# EAGLE schematic E-Reader (EAGLE 9.7.0)
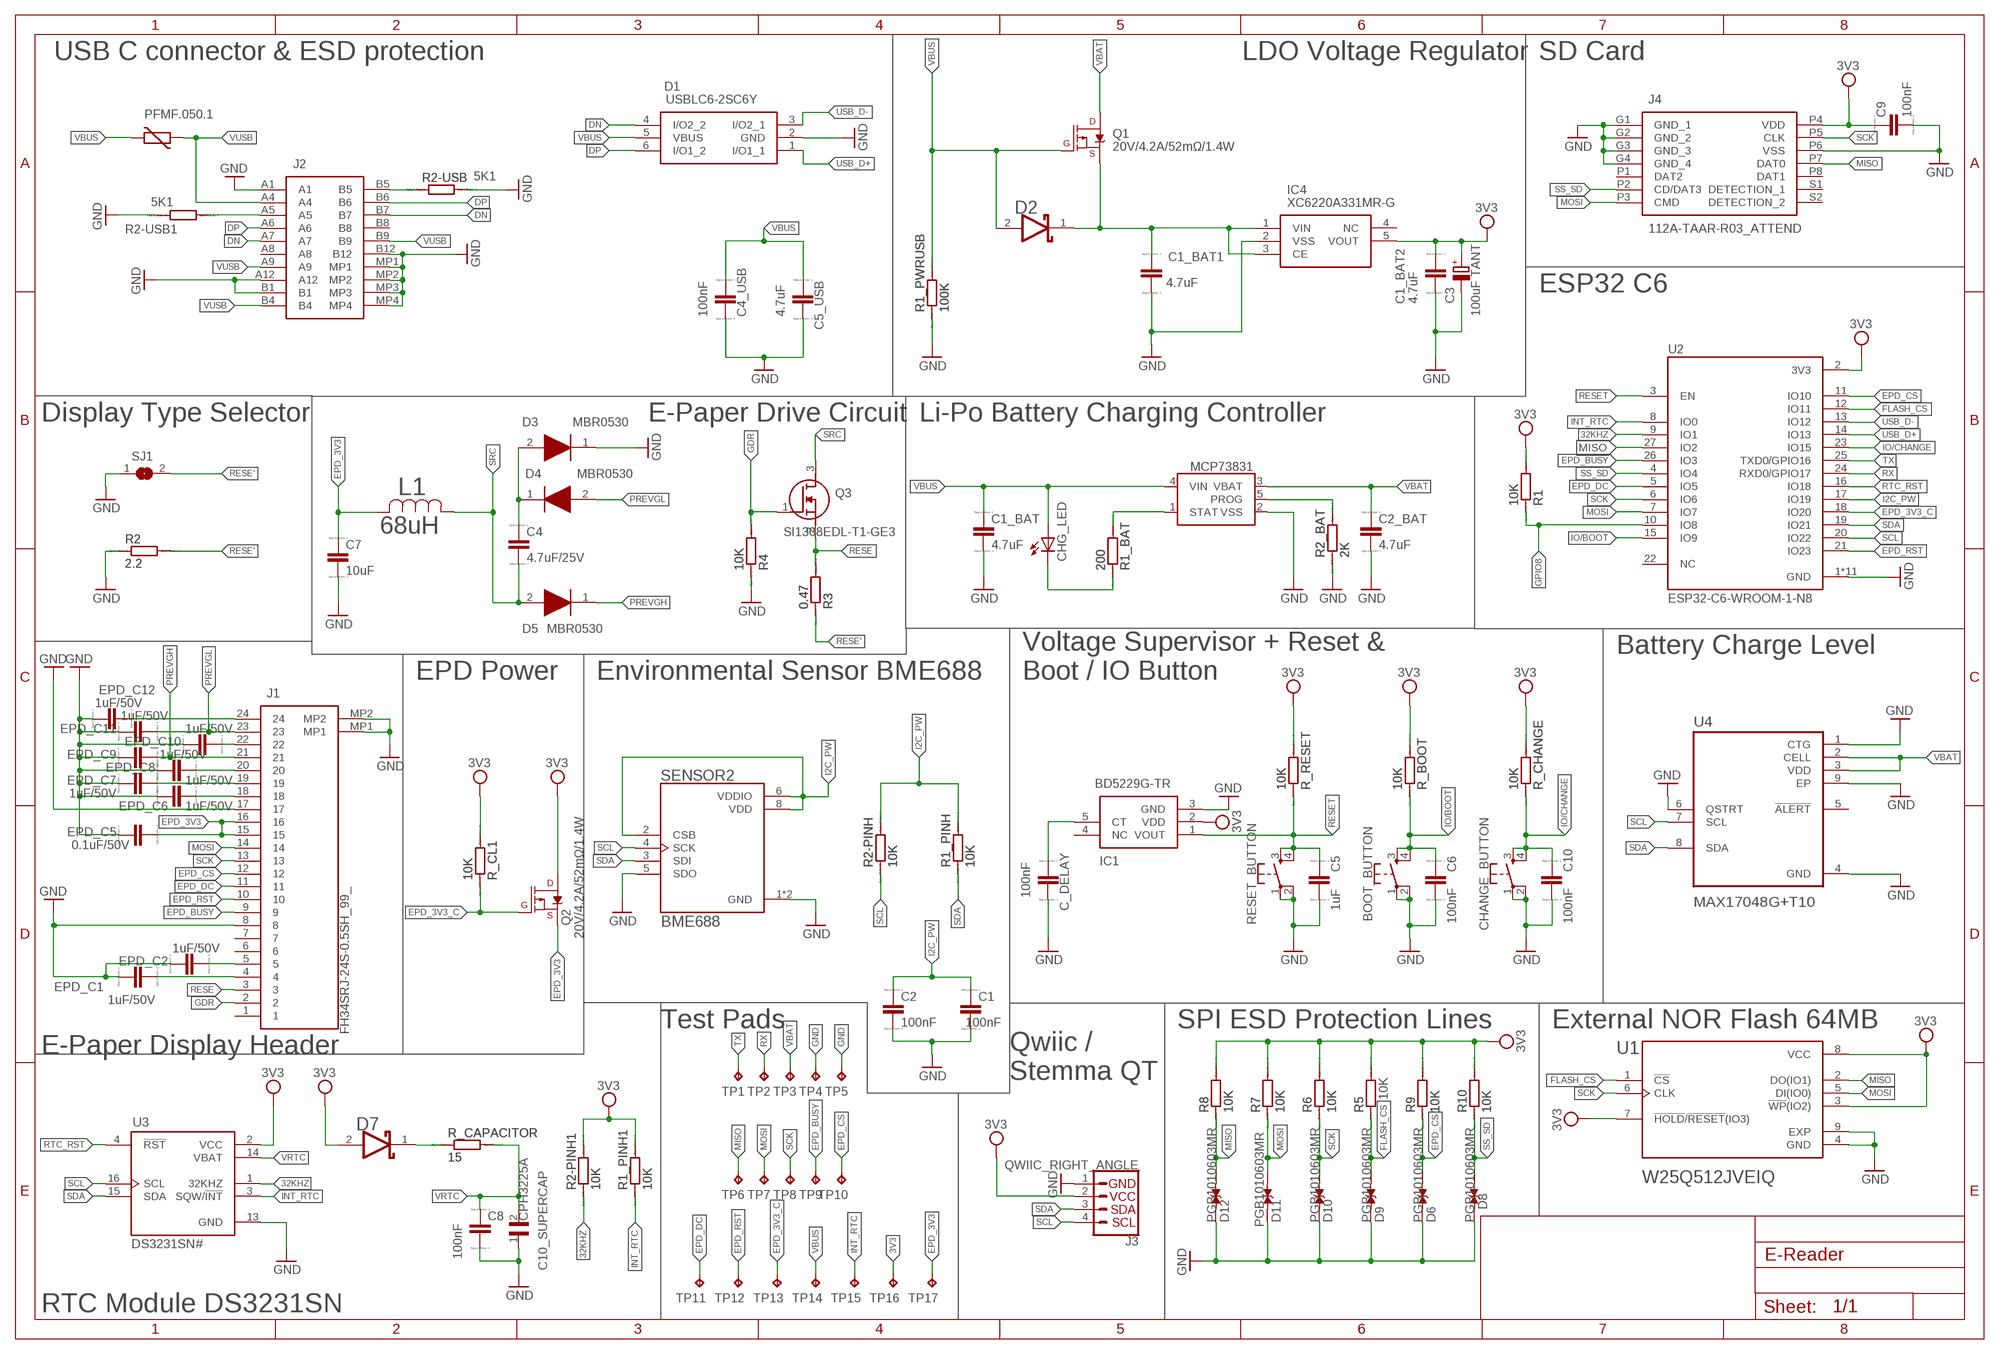
[diagram p0: schematic, sheet 1]

## Parts
BOOT_BUTTON  BUTTON_CUSYOMV1  [MYBUTTON]
C1  100nF  EAGLE-LTSPICE_CC0402  [EAGLE-LTSPICE_C0402]
C1_BAT  4.7uF  EAGLE-LTSPICE_CC0402  [EAGLE-LTSPICE_C0402]
C1_BAT1  4.7uF  EAGLE-LTSPICE_CC0402  [EAGLE-LTSPICE_C0402]
C1_BAT2  4.7uF  EAGLE-LTSPICE_CC0402  [EAGLE-LTSPICE_C0402]
C2  100nF  EAGLE-LTSPICE_CC0402  [EAGLE-LTSPICE_C0402]
C2_BAT  4.7uF  EAGLE-LTSPICE_CC0402  [EAGLE-LTSPICE_C0402]
C3  100uF TANT  RCL_CPOL-EUCT3528  [RCL_CT3528]
C4  4.7uF/25V  EAGLE-LTSPICE_CC0402  [EAGLE-LTSPICE_C0402]
C4_USB  100nF  EAGLE-LTSPICE_CC0402  [EAGLE-LTSPICE_C0402]
C5  1uF  EAGLE-LTSPICE_CC0402  [EAGLE-LTSPICE_C0402]
C5_USB  4.7uF  EAGLE-LTSPICE_CC0402  [EAGLE-LTSPICE_C0402]
C6  100nF  EAGLE-LTSPICE_CC0402  [EAGLE-LTSPICE_C0402]
C7  10uF  EAGLE-LTSPICE_CC0402  [EAGLE-LTSPICE_C0402]
C8  100nF  EAGLE-LTSPICE_CC0402  [EAGLE-LTSPICE_C0402]
C9  100nF  EAGLE-LTSPICE_CC0402  [EAGLE-LTSPICE_C0402]
C10  100nF  EAGLE-LTSPICE_CC0402  [EAGLE-LTSPICE_C0402]
C10_SUPERCAP  CPH3225A  [CAPCP3225X100N]
C_DELAY  100nF  EAGLE-LTSPICE_CC0402  [EAGLE-LTSPICE_C0402]
CHANGE_BUTTON  BUTTON_CUSYOMV1  [MYBUTTON]
CHG_LED  ADAFRUIT_LEDCHIP-LED0603  [ADAFRUIT_CHIP-LED0603]
D1  USBLC6-2SC6Y  [SOT95P280X145-6N]
D2  ESP32_WROVER_AVX---SD0805S020S1R0_AVX_SD0805S020S1R0_0_0AVX_SD0805S020S1R0_0_0  [ESP32_WROVER_AVX---SD0805S020S1R0_AVX_SD0805S020S1R0_0]
D3  MBR0530  [SOD3716X135N]
D4  MBR0530  [SOD3716X135N]
D5  MBR0530  [SOD3716X135N]
D6  PGB1010603MR  [DIOC1608X36N]
D7  ESP32_WROVER_AVX---SD0805S020S1R0_AVX_SD0805S020S1R0_0_0AVX_SD0805S020S1R0_0_0  [ESP32_WROVER_AVX---SD0805S020S1R0_AVX_SD0805S020S1R0_0]
D8  PGB1010603MR  [DIOC1608X36N]
D9  PGB1010603MR  [DIOC1608X36N]
D10  PGB1010603MR  [DIOC1608X36N]
D11  PGB1010603MR  [DIOC1608X36N]
D12  PGB1010603MR  [DIOC1608X36N]
EPD_C1  1uF/50V  EAGLE-LTSPICE_CC0402  [EAGLE-LTSPICE_C0402]
EPD_C2  1uF/50V  EAGLE-LTSPICE_CC0402  [EAGLE-LTSPICE_C0402]
EPD_C5  0.1uF/50V  EAGLE-LTSPICE_CC0402  [EAGLE-LTSPICE_C0402]
EPD_C6  1uF/50V  EAGLE-LTSPICE_CC0402  [EAGLE-LTSPICE_C0402]
EPD_C7  1uF/50V  EAGLE-LTSPICE_CC0402  [EAGLE-LTSPICE_C0402]
EPD_C8  1uF/50V  EAGLE-LTSPICE_CC0402  [EAGLE-LTSPICE_C0402]
EPD_C9  1uF/50V  EAGLE-LTSPICE_CC0402  [EAGLE-LTSPICE_C0402]
EPD_C10  1uF/50V  EAGLE-LTSPICE_CC0402  [EAGLE-LTSPICE_C0402]
EPD_C11  1uF/50V  EAGLE-LTSPICE_CC0402  [EAGLE-LTSPICE_C0402]
EPD_C12  1uF/50V  EAGLE-LTSPICE_CC0402  [EAGLE-LTSPICE_C0402]
IC1  BD5229G-TR  [SOT95P280X125-5N]
IC4  XC6220A331MR-G  [SOT95P280X120-5N]
J1  FH34SRJ-24S-0.5SH_99_  [FH34SRJ24S05SH99]
J2  SAMACSYS_PARTS_USB4110-GF-A  [SAMACSYS_PARTS_USB4110GFA]
J3  QWIIC_RIGHT_ANGLE  QWIIC_CONNECTORJS-1MM  [JST04_1MM_RA]
J4  112A-TAAR-R03_ATTEND  [112ATAARR03ATTEND]
L1  68uH  744043680IND_4828-WE-TPC_WRE  [IND_4828-WE-TPC_WRE]
MCP73831  ESP32_WROVER_SPARKFUN-IC-POWER_MCP73831  [ESP32_WROVER_SPARKFUN-IC-POWER_SOT23-5]
PFMF.050.1  ESP32C6_VARISTORCN1812  [ESP32C6_VARISTOR_CT/CN1812]
Q1  20V/4.2A/52mΩ/1.4W  ESP32_WROVER_SPARKFUN-DISCRETESEMI_MOSFET_PCH-DMG2305UX-7  [ESP32_WROVER_SPARKFUN-DISCRETESEMI_SOT23-3]
Q2  20V/4.2A/52mΩ/1.4W  ESP32_WROVER_SPARKFUN-DISCRETESEMI_MOSFET_PCH-DMG2305UX-7  [ESP32_WROVER_SPARKFUN-DISCRETESEMI_SOT23-3]
Q3  SI1308EDL-T1-GE3  [SOT65P210X110-3N]
R1  10K  ESP32_WROVER_EAGLE-LTSPICE_RR0402  [ESP32_WROVER_EAGLE-LTSPICE_R0402]
R1_BAT  200  ESP32_WROVER_EAGLE-LTSPICE_RR0402  [ESP32_WROVER_EAGLE-LTSPICE_R0402]
R1_PINH  10K  ESP32_WROVER_EAGLE-LTSPICE_RR0402  [ESP32_WROVER_EAGLE-LTSPICE_R0402]
R1_PINH1  10K  ESP32_WROVER_EAGLE-LTSPICE_RR0402  [ESP32_WROVER_EAGLE-LTSPICE_R0402]
R1_PWRUSB  100K  ESP32_WROVER_EAGLE-LTSPICE_RR0402  [ESP32_WROVER_EAGLE-LTSPICE_R0402]
R2  2.2  ESP32_WROVER_EAGLE-LTSPICE_RR0402  [ESP32_WROVER_EAGLE-LTSPICE_R0402]
R2-PINH  10K  ESP32_WROVER_EAGLE-LTSPICE_RR0402  [ESP32_WROVER_EAGLE-LTSPICE_R0402]
R2-PINH1  10K  ESP32_WROVER_EAGLE-LTSPICE_RR0402  [ESP32_WROVER_EAGLE-LTSPICE_R0402]
R2-USB  5K1  ESP32_WROVER_EAGLE-LTSPICE_RR0402  [ESP32_WROVER_EAGLE-LTSPICE_R0402]
R2-USB1  5K1  ESP32_WROVER_EAGLE-LTSPICE_RR0402  [ESP32_WROVER_EAGLE-LTSPICE_R0402]
R2_BAT  2K  ESP32_WROVER_EAGLE-LTSPICE_RR0402  [ESP32_WROVER_EAGLE-LTSPICE_R0402]
R3  0.47  ESP32_WROVER_EAGLE-LTSPICE_RR0402  [ESP32_WROVER_EAGLE-LTSPICE_R0402]
R4  10K  ESP32_WROVER_EAGLE-LTSPICE_RR0402  [ESP32_WROVER_EAGLE-LTSPICE_R0402]
R5  10K  ESP32_WROVER_EAGLE-LTSPICE_RR0402  [ESP32_WROVER_EAGLE-LTSPICE_R0402]
R6  10K  ESP32_WROVER_EAGLE-LTSPICE_RR0402  [ESP32_WROVER_EAGLE-LTSPICE_R0402]
R7  10K  ESP32_WROVER_EAGLE-LTSPICE_RR0402  [ESP32_WROVER_EAGLE-LTSPICE_R0402]
R8  10K  ESP32_WROVER_EAGLE-LTSPICE_RR0402  [ESP32_WROVER_EAGLE-LTSPICE_R0402]
R9  10K  ESP32_WROVER_EAGLE-LTSPICE_RR0402  [ESP32_WROVER_EAGLE-LTSPICE_R0402]
R10  10K  ESP32_WROVER_EAGLE-LTSPICE_RR0402  [ESP32_WROVER_EAGLE-LTSPICE_R0402]
R_BOOT  10K  ESP32_WROVER_EAGLE-LTSPICE_RR0402  [ESP32_WROVER_EAGLE-LTSPICE_R0402]
R_CAPACITOR  15  ESP32_WROVER_EAGLE-LTSPICE_RR0402  [ESP32_WROVER_EAGLE-LTSPICE_R0402]
R_CHANGE  10K  ESP32_WROVER_EAGLE-LTSPICE_RR0402  [ESP32_WROVER_EAGLE-LTSPICE_R0402]
R_CL1  10K  ESP32_WROVER_EAGLE-LTSPICE_RR0402  [ESP32_WROVER_EAGLE-LTSPICE_R0402]
R_RESET  10K  ESP32_WROVER_EAGLE-LTSPICE_RR0402  [ESP32_WROVER_EAGLE-LTSPICE_R0402]
RESET_BUTTON  BUTTON_CUSYOMV1  [MYBUTTON]
SENSOR2  BME688  ESP32_WROVER_BME680_BME680  [ESP32_WROVER_BME680_PSON80P300X300X100-8N]
SJ1  SJ  [SJ]
TP1  TPTP20R  [TP20R]
TP2  TPTP20R  [TP20R]
TP3  TPTP20R  [TP20R]
TP4  TPTP20R  [TP20R]
TP5  TPTP20R  [TP20R]
TP6  TPTP20R  [TP20R]
TP7  TPTP20R  [TP20R]
TP8  TPTP20R  [TP20R]
TP9  TPTP20R  [TP20R]
TP10  TPTP20R  [TP20R]
TP11  TPTP20R  [TP20R]
TP12  TPTP20R  [TP20R]
TP13  TPTP20R  [TP20R]
TP14  TPTP20R  [TP20R]
TP15  TPTP20R  [TP20R]
TP16  TPTP20R  [TP20R]
TP17  TPTP20R  [TP20R]
U1  W25Q512JVEIQ  [SON127P600X800X80-9N]
U2  ESP32-C6-WROOM-1-N8  [XCVR_ESP32-C6-WROOM-1-N8]
U3  DS3231SN#  [SOIC127P1032X265-16N]
U4  MAX17048G+T10  [SON50P200X200X80-9N]

## Nets
3V3: C1_BAT2.1 C3.+ C9.1 D7.2(ANODE) IC1.2(VDD) IC4.5(VOUT) J3.2 J4.P4(VDD) Q2.3(D) R1.2 R1_PINH1.2 R2-PINH1.2 R5.2 R6.2 R7.2 R8.2 R9.2 R10.2 R_BOOT.2 R_CHANGE.2 R_CL1.2 R_RESET.2 TP16.TP U1.3(!WP!(IO2)) U1.7(!HOLD!/!RESET!(IO3)) U1.8(VCC) U2.2(3V3) U3.2(VCC)
32KHZ: R2-PINH1.1 U2.9(IO1) U3.1(32KHZ)
DN: D1.4(I/O2_2) J2.A7 J2.B7
DP: D1.6(I/O1_2) J2.A6 J2.B6
EPD_3V3: C7.1 EPD_C5.2 J1.15 J1.16 L1.2 Q2.2(S) TP17.TP
EPD_3V3_C: Q2.1(G) R_CL1.1 TP13.TP U2.18(IO20)
EPD_BUSY: J1.9 TP9.TP U2.26(IO3)
EPD_CS: D6.2 J1.12 R9.1 TP10.TP U2.11(IO10)
EPD_DC: J1.11 TP11.TP U2.5(IO5)
EPD_RST: J1.10 TP12.TP U2.21(IO23)
FLASH_CS: D9.2 R5.1 U1.1(!CS) U2.12(IO11)
GDR: J1.2 Q3.1(G) R4.2
GND: BOOT_BUTTON.1 BOOT_BUTTON.2 C1.2 C1_BAT1.2 C1_BAT2.2 C1_BAT.2 C2.2 C2_BAT.2 C3.- C4_USB.2 C5.2 C5_USB.2 C6.2 C7.2 C8.2 C9.2 C10.2 C10_SUPERCAP.1 C_DELAY.2 CHANGE_BUTTON.1 CHANGE_BUTTON.2 D1.2(GND) D3.1(K) D6.1 D8.1 D9.1 D10.1 D11.1 D12.1 EPD_C1.1 EPD_C2.1 EPD_C5.1 EPD_C6.1 EPD_C7.1 EPD_C8.1 EPD_C9.1 EPD_C10.1 EPD_C11.1 EPD_C12.1 IC1.3(GND) IC4.2(VSS) J1.8 J1.17 J1.MP1 J1.MP2 J2.A1 J2.A12 J2.B1 J2.B12 J2.MP1 J2.MP2 J2.MP3 J2.MP4 J3.1 J4.G1(GND_1) J4.G2(GND_2) J4.G3(GND_3) J4.G4(GND_4) J4.P6(VSS) MCP73831.2(VSS) R1_PWRUSB.1 R2-USB1.1 R2-USB.2 R2.1 R2_BAT.1 R4.1 RESET_BUTTON.1 RESET_BUTTON.2 SENSOR2.1(GND) SENSOR2.5(SDO) SENSOR2.7(GND) SJ1.1 TP4.TP TP5.TP U1.4(GND) U1.9(EXP) U2.1(GND) U2.28(GND) U2.29_1(GND) U2.29_2(GND) U2.29_3(GND) U2.29_4(GND) U2.29_5(GND) U2.29_6(GND) U2.29_7(GND) U2.29_8(GND) U2.29_9(GND) U3.13(GND) U4.1(CTG) U4.4(GND) U4.6(QSTRT) U4.9(EP)
GPIO8: R1.1 U2.10(IO8)
I2C_PW: C1.1 C2.1 R1_PINH.2 R2-PINH.2 SENSOR2.2(CSB) SENSOR2.6(VDDIO) SENSOR2.8(VDD) U2.17(IO19)
INT_RTC: R1_PINH1.1 TP15.TP U2.8(IO0) U3.3(SQW/!INT)
IO/BOOT: BOOT_BUTTON.3 BOOT_BUTTON.4 C6.1 R_BOOT.1 U2.15(IO9)
IO/CHANGE: C10.1 CHANGE_BUTTON.3 CHANGE_BUTTON.4 R_CHANGE.1 U2.23(IO15)
MISO: D12.2 J4.P7(DAT0) R8.1 TP6.TP U1.2(DO(IO1)) U2.27(IO2)
MOSI: D11.2 J1.14 J4.P3(CMD) R7.1 TP7.TP U1.5(DI(IO0)) U2.7(IO7)
N$1: C1_BAT1.1 D2.1(CATHODE) IC4.1(VIN) IC4.3(CE) Q1.2(S)
N$2: MCP73831.5(PROG) R2_BAT.2
N$3: MCP73831.1(STAT) R1_BAT.2
N$4: CHG_LED.C R1_BAT.1
N$5: C_DELAY.1 IC1.5(CT)
N$6: EPD_C6.2 J1.18
N$7: C4.1 D3.2(A) D4.1(K)
N$8: EPD_C7.2 J1.19
N$9: EPD_C1.2 J1.4
N$11: EPD_C2.2 J1.5
N$12: D7.1(CATHODE) R_CAPACITOR.1
N$13: EPD_C8.2 J1.20
N$14: J2.B5 R2-USB.1
N$17: EPD_C10.2 J1.22
N$18: J2.A5 R2-USB1.2
N$20: EPD_C12.2 J1.24
PREVGH: D5.1(K) EPD_C9.2 J1.21
PREVGL: D4.2(A) EPD_C11.2 J1.23
RESE: J1.3 Q3.2(S) R3.2
RESE': R2.2 R3.1 SJ1.2
RESET: C5.1 IC1.1(VOUT) R_RESET.1 RESET_BUTTON.3 RESET_BUTTON.4 U2.3(EN)
RTC_RST: U2.16(IO18) U3.4(!RST)
RX: TP2.TP U2.24(RXD0/GPIO17)
SCK: D10.2 J1.13 J4.P5(CLK) R6.1 TP8.TP U1.6(CLK) U2.6(IO6)
SCL: J3.4 R2-PINH.1 SENSOR2.4(SCK) U2.20(IO22) U3.16(SCL) U4.7(SCL)
SDA: J3.3 R1_PINH.1 SENSOR2.3(SDI) U2.19(IO21) U3.15(SDA) U4.8(SDA)
SRC: C4.2 D5.2(A) L1.1 Q3.3(D)
SS_SD: D8.2 J4.P2(CD/DAT3) R10.1 U2.4(IO4)
TX: TP1.TP U2.25(TXD0/GPIO16)
USB_D+: D1.1(I/O1_1) U2.14(IO13)
USB_D-: D1.3(I/O2_1) U2.13(IO12)
VBAT: C2_BAT.1 MCP73831.3(VBAT) Q1.3(D) TP3.TP U4.2(CELL) U4.3(VDD)
VBUS: C1_BAT.1 C4_USB.1 C5_USB.1 CHG_LED.A D1.5(VBUS) D2.2(ANODE) MCP73831.4(VIN) PFMF.050.1.2 Q1.1(G) R1_PWRUSB.2 TP14.TP
VRTC: C8.1 C10_SUPERCAP.2 R_CAPACITOR.2 U3.14(VBAT)
VUSB: J2.A4 J2.A9 J2.B4 J2.B9 PFMF.050.1.1
Unconnected: IC1.4(NC) IC4.4(NC) J1.1 J1.6 J1.7 J2.A8 J2.B8 J4.P1(DAT2) J4.P8(DAT1) J4.S1(DETECTION_1) J4.S2(DETECTION_2) U2.22(NC) U4.5(!ALERT)

## Notes on the sheet
- USB C connector & ESD protection | LDO Voltage Regulator | SD Card
- ESP32 C6
- Display Type Selector | E-Paper Drive Circuit | Li-Po Battery Charging Controller
- Battery Charge Level
- EPD Power | Environmental Sensor BME688
- Voltage Supervisor + Reset &
  Boot / IO Button
- Test Pads | SPI ESD Protection Lines | External NOR Flash 64MB
- E-Paper Display Header
- Qwiic /
  Stemma QT
- RTC Module DS3231SN

## Library data of the parts
BOOT_BUTTON CHANGE_BUTTON RESET_BUTTON = DeskAssistant v19 v1:BUTTON_CUSYOMV1
C1 C1_BAT C1_BAT1 C1_BAT2 C2 C2_BAT C4 C4_USB C5 C5_USB C6-C10 C_DELAY EPD_C1 EPD_C2 EPD_C5-EPD_C12 = DeskAssistant v19 v1:EAGLE-LTSPICE_C: CAPACITOR, European symbol; SPICEMODEL: NONE; SPICEPREFIX: C
C3 = DeskAssistant v19 v1:RCL_CPOL-EU: POLARIZED CAPACITOR, European symbol; SPICEPREFIX: C
C10_SUPERCAP = DeskAssistant v19 v1:CPH3225A: Cap 0.011F 3.3V 1210 Flat Check availability <https://pricing.snapeda.com/parts/CPH3225A/Seiko%20Instruments/view-part?ref=eda>; AVAILABILITY: Not in stock; CHECK_PRICES: https://www.snapeda.com/parts/CPH3225A/Seiko+Instruments/view-part/?ref=eda; DESCRIPTION: 11 mF (EDLC) Supercapacitor 3.3 V 1210 (3225 Metric) - -; MF: Seiko Instruments; MP: CPH3225A; PACKAGE: 1210 Seiko; PRICE: None; PURCHASE-URL: https://www.snapeda.com/api/url_track_click_mouser/?unipart_id=562593&manufacturer=Seiko Instruments&part_name=CPH3225A&search_term=None; SNAPEDA_LINK: https://www.snapeda.com/parts/CPH3225A/Seiko+Instruments/view-part/?ref=snap
CHG_LED = DeskAssistant v19 v1:ADAFRUIT_LED: LED OSRAM: - CHIPLED LG R971, LG N971, LY N971, LG Q971, LY Q971, LO R971, LY R971 LH N974, LH R974 LS Q976, LO Q976, LY Q976 LO Q996 - Hyper CHIPLED LW Q18S LB Q993, LB Q99A, LB R99A - SideLED LS A670, LO A670, LY A670, LG A670, LP A670 LB A673, LV A673, LT A673, LW A673 LH A674 LY A675 LS A676, LA A676, LO A676, LY A676, LW A676 LS A679, LY A679, LG A679 - Hyper Micro SIDELED® LS Y876, LA Y876, LO Y876, LY Y876 LT Y87S - SmartLED LW L88C, LW L88S LB L89C, LB L89S, LG L890 LS L89K, LO L89K, LY L89K LS L896, LA L896, LO L896, LY L896 - TOPLED LS T670, LO T670, LY T670, LG T670, LP T670 LSG T670, LSP T670, LSY T670, LOP T670, LYG T670 LG T671, LOG T671, LSG T671 LB T673, LV T673, LT T673, LW T673 LH T674 LS T676, LA T676, LO T676, LY T676, LB T676, LH T676, LSB T676, LW T676 LB T67C, LV T67C, LT T67C, LS T67K, LO T67K, LY T67K, LW E67C LS E67B, LA E67B, LO E67B, LY E67B, LB E67C, LV E67C, LT E67C LW T67C LS T679, LY T679, LG T679 LS T770, LO T770, LY T770, LG T770, LP T770 LB T773, LV T773, LT T773, LW T773 LH T774 LS E675, LA E675, LY E675, LS T675 LS T776, LA T776, LO T776, LY T776, LB T776 LHGB T686 LT T68C, LB T68C - Hyper Mini TOPLED® LB M676 - Mini TOPLED Santana® LG M470 LS M47K, LO M47K, LY M47K Source: http://www.osram.convergy.de/
D1 = DeskAssistant v19 v1:USBLC6-2SC6Y: Low Cap. ESD Protection Auto SOT-23-6 STMicroelectronics USBLC6-2SC6Y, Dual Uni-Directional TVS Diode Array, 6-Pin SOT-23 Source: Datasheet <https://componentsearchengine.com/Datasheets/1/USBLC6-2SC6Y.pdf> Check availability <https://pricing.snapeda.com/parts/USBLC6-2SC6Y/STMicroelectronics/view-part?ref=eda>; AVAILABILITY: In Stock; CHECK_PRICES: https://www.snapeda.com/parts/USBLC6-2SC6Y/STMicroelectronics/view-part/?ref=eda; DESCRIPTION: 17V Clamp 5A (8/20µs) Ipp Tvs Diode Surface Mount SOT-23-6; MF: STMicroelectronics; MP: USBLC6-2SC6Y; PACKAGE: SOT-23-6 STMicroelectronics; PRICE: None; SNAPEDA_LINK: https://www.snapeda.com/parts/USBLC6-2SC6Y/STMicroelectronics/view-part/?ref=snap
D2 D7 = DeskAssistant v19 v1:ESP32_WROVER_AVX---SD0805S020S1R0_AVX_SD0805S020S1R0_0_0: Schottky Barrier Rectifier Diode; CENTROID_NOT_SPECIFIED: No; DATASHEET: http://datasheets.avx.com/schottky.pdf; DIGIKEY_DESCRIPTION: DIODE SCHOTTKY 20V 1A 0805; DIGIKEY_PART_NUMBER: 478-7800-1-ND; LEAD_FREE: yes; MF: AVX; MOUSER_PART_NUMBER: 581-SD0805S020S1R0; PACKAGE: 0805 (2012 metric); PREFIX: D; ROHS: yes; TEMPERATURE_RANGE_HIGH: +125°C; TEMPERATURE_RANGE_LOW: -55°C
D3-D5 = DeskAssistant v19 v1:MBR0530: ON SEMICONDUCTOR - MBR0530 - DIODE, SCHOTTKY, 0.5A, 30V, SOD-123 Source: Datasheet <http://www.onsemi.com/pub/Collateral/MBR0530T1-D.PDF> Check availability <https://pricing.snapeda.com/parts/MBR0530/ON%20Semiconductor/view-part?ref=eda>; AVAILABILITY: In Stock; CHECK_PRICES: https://www.snapeda.com/parts/MBR0530/Onsemi/view-part/?ref=eda; DESCRIPTION: Diode Schottky 30 V 500mA Surface Mount SOD-123; MF: ON Semiconductor; MP: MBR0530; PACKAGE: SOD-123-2 ON Semiconductor; PRICE: None; PURCHASE-URL: https://www.snapeda.com/api/url_track_click_mouser/?unipart_id=179458&manufacturer=ON Semiconductor&part_name=MBR0530&search_term=None; SNAPEDA_LINK: https://www.snapeda.com/parts/MBR0530/Onsemi/view-part/?ref=snap
D6 D8-D12 = DeskAssistant v19 v1:PGB1010603MR: Check availability <https://pricing.snapeda.com/parts/PGB1010603MR/Littelfuse%20Inc./view-part?ref=eda>; AVAILABILITY: In Stock; CHECK_PRICES: https://www.snapeda.com/parts/PGB1010603MR/Littelfuse/view-part/?ref=eda; DESCRIPTION: 150V (Typ) Clamp - Ipp Tvs Diode Surface Mount 0603 (1608 Metric); MF: Littelfuse Inc.; MP: PGB1010603MR; PACKAGE: 0603 Littelfuse Inc.; PRICE: None; PURCHASE-URL: https://www.snapeda.com/api/url_track_click_mouser/?unipart_id=5659453&manufacturer=Littelfuse Inc.&part_name=PGB1010603MR&search_term=None; SNAPEDA_LINK: https://www.snapeda.com/parts/PGB1010603MR/Littelfuse/view-part/?ref=snap
IC1 = DeskAssistant v19 v1:BD5229G-TR: Voltage Detector with Adjustable Delay Time: CMOS processes are utilized to develop high precision, low current consumption CMOS reset ICs that allow arbitrary setting of the delay time. The extensive lineup includes both Nch Open Drain and CMOS output types in a wide range of detection voltages (from 2.3V to 6.0V, in 0.1V steps), enabling selection of the ideal solution based on customer requirements. In addition, the entire series is of course both lead-free and RoHS-compliant. Source: Datasheet <https://datasheet.datasheetarchive.com/originals/distributors/Datasheets_SAMA/f2b9741ef86007909f138d561a359946.pdf>; DESCRIPTION: Voltage Detector with Adjustable Delay Time: CMOS processes are utilized to develop high precision, low current consumption CMOS reset ICs that allow arbitrary setting of the delay time. The extensive lineup includes both Nch Open Drain and CMOS output types in a wide range of detection voltages (from 2.3V to 6.0V, in 0.1V steps), enabling selection of the ideal solution based on customer requirements. In addition, the entire series is of course both lead-free and RoHS-compliant.; HEIGHT: 1.25mm; MANUFACTURER_NAME: ROHM Semiconductor; MANUFACTURER_PART_NUMBER: BD5229G-TR; MOUSER_PART_NUMBER: 755-BD5229G-TR; MOUSER_PRICE-STOCK: https://www.mouser.co.uk/ProductDetail/ROHM-Semiconductor/BD5229G-TR?qs=4kLU8WoGk0vvnhrrYwdszw%3D%3D
IC4 = DeskAssistant v19 v1:XC6220A331MR-G: LDO Voltage Regulators Source: Datasheet <https://www.torexsemi.com/file/xc6220/XC6220.pdf>; DESCRIPTION: LDO Voltage Regulators; HEIGHT: 1.2mm; MANUFACTURER_NAME: Torex; MANUFACTURER_PART_NUMBER: XC6220A331MR-G; MOUSER_PART_NUMBER: 865-XC6220A331MR-G; MOUSER_PRICE-STOCK: https://www.mouser.co.uk/ProductDetail/Torex-Semiconductor/XC6220A331MR-G?qs=AsjdqWjXhJ8ZSWznL1J0gg%3D%3D
J1 = DeskAssistant v19 v1:FH34SRJ-24S-0.5SH_99_: 24 Position FFC, FPC Connector Contacts, Top and Bottom 0.020" (0.50mm) Surface Mount, Right Angle Source: Datasheet <https://www.hirose.com/en/product/document?clcode=CL0580-1255-6-99&productname=FH34SRJ-24S-0.5SH(99)&series=FH34SRJ&documenttype=2DDrawing&lang=en&documentid=0000990903>; DESCRIPTION: 24 Position FFC, FPC Connector Contacts, Top and Bottom 0.020" (0.50mm) Surface Mount, Right Angle; HEIGHT: 1.1mm; MANUFACTURER_NAME: Hirose; MANUFACTURER_PART_NUMBER: FH34SRJ-24S-0.5SH(99); MOUSER_PART_NUMBER: 798-FH34SRJ24S05SH99; MOUSER_PRICE-STOCK: https://www.mouser.co.uk/ProductDetail/Hirose-Connector/FH34SRJ-24S-0.5SH99?qs=vcbW%252B4%252BSTIpKBl5ap9J8Fw%3D%3D
J2 = DeskAssistant v19 v1:SAMACSYS_PARTS_USB4110-GF-A: CONN USB 2.0 TYPE-C R/A SMT Source: Datasheet <https://gct.co/files/drawings/usb4110.pdf>; DESCRIPTION: CONN USB 2.0 TYPE-C R/A SMT; HEIGHT: 3.26mm; MANUFACTURER_NAME: GCT (GLOBAL CONNECTOR TECHNOLOGY); MANUFACTURER_PART_NUMBER: USB4110-GF-A; MOUSER_PART_NUMBER: 640-USB4110-GF-A; MOUSER_PRICE-STOCK: https://www.mouser.co.uk/ProductDetail/GCT/USB4110-GF-A?qs=KUoIvG%2F9IlYiZvIXQjyJeA%3D%3D
J3 = DeskAssistant v19 v1:QWIIC_CONNECTOR: SparkFun I2C Standard Qwiic Connector An SMD 1mm pitch JST connector makes it easy and quick (get it? Qwiic?) to connect I2C devices to each other. The Qwiic system <http://www.sparkfun.com/qwiic> enables fast and solderless connection between popular platforms and various sensors and actuators. We carry 200mm <https://www.sparkfun.com/products/14204>, 100mm <https://www.sparkfun.com/products/14205>, 50mm <https://www.sparkfun.com/products/14206>, and breadboard friendly <https://www.sparkfun.com/products/14207> Qwiic cables. We also offer 10 pcs strips <https://www.sparkfun.com/products/14323> the SMD connectors.; PROD_ID: CONN-13694
J4 = DeskAssistant v19 v1:112A-TAAR-R03_ATTEND: Micro SD Card Socket, Push-Push Type, Top Mount, SMT, H=1.83mm, 10u Source: Datasheet <https://www.attend.com.tw/data/download/file/112A-TAAR-R03.pdf>; DESCRIPTION: Micro SD Card Socket, Push-Push Type, Top Mount, SMT, H=1.83mm, 10u; HEIGHT: 1.9mm; MANUFACTURER_NAME: ATTEND; MANUFACTURER_PART_NUMBER: 112A-TAAR-R03 ATTEND
L1 = DeskAssistant v19 v1:744043680; COPYRIGHT: Copyright (C) 2024 Ultra Librarian. All rights reserved.; MANUFACTURER_PART_NUMBER: 744043680; MFR_NAME: Wurth Electronics
MCP73831 = DeskAssistant v19 v1:ESP32_WROVER_SPARKFUN-IC-POWER_MCP73831: MCP73831T Li-Ion, Li-Pol Controller Miniature single cell, fully integrated Li-Ion, Li-polymer charge management controller Datasheet <http://ww1.microchip.com/downloads/en/DeviceDoc/20001984g.pdf> SparkFun Products: SparkFun ESP32 Thing <https://www.sparkfun.com/products/13907> SparkFun 9DoF Razor IMU M0 <https://www.sparkfun.com/products/14001>; PROD_ID: IC-09995
PFMF.050.1 = DeskAssistant v19 v1:ESP32C6_VARISTOR: VARISTOR
Q1 Q2 = DeskAssistant v19 v1:ESP32_WROVER_SPARKFUN-DISCRETESEMI_MOSFET_PCH: P-channel MOSFETs Voltage controlled devices that allow control of high current outputs. SparkFun Products: SparkFun ESP32 Thing <https://www.sparkfun.com/products/13907> SparkFun ESP8266 Thing <https://www.sparkfun.com/products/13231> SparkFun Pi Servo HAT V2 <https://www.sparkfun.com/products/15316> DMG2305UX-7 (20V/4.2A/SOT23-3); PROD_ID: TRAN-14388
Q3 = DeskAssistant v19 v1:SI1308EDL-T1-GE3: MOSFET N-Ch 30V 1.5A TrenchFET SC70 Vishay Si1308EDL-T1-GE3 N-channel MOSFET Transistor, 1.5 A, 30 V, 3-Pin SC-70 Source: Datasheet <https://componentsearchengine.com/Datasheets/1/SI1308EDL-T1-GE3.pdf> Check availability <https://pricing.snapeda.com/parts/SI1308EDL-T1-GE3/Vishay%20Siliconix/view-part?ref=eda>; AVAILABILITY: In Stock; CHECK_PRICES: https://www.snapeda.com/parts/SI1308EDL-T1-GE3/Vishay+Siliconix/view-part/?ref=eda; DESCRIPTION: Si1308EDL-T1-GE3 N-channel MOSFET Transistor, 1.5 A, 30 V, 3-Pin SC-70 | Siliconix / Vishay SI1308EDL-T1-GE3; MF: Vishay Siliconix; MP: SI1308EDL-T1-GE3; PACKAGE: SOT-323 Vishay Semiconductor; PRICE: None; PURCHASE-URL: https://www.snapeda.com/api/url_track_click_mouser/?unipart_id=274603&manufacturer=Vishay Siliconix&part_name=SI1308EDL-T1-GE3&search_term=None; SNAPEDA_LINK: https://www.snapeda.com/parts/SI1308EDL-T1-GE3/Vishay+Siliconix/view-part/?ref=snap
R1 R1_BAT R1_PINH R1_PINH1 R1_PWRUSB R2 R2-PINH R2-PINH1 R2-USB R2-USB1 R2_BAT R3-R10 R_BOOT R_CAPACITOR R_CHANGE R_CL1 R_RESET = DeskAssistant v19 v1:ESP32_WROVER_EAGLE-LTSPICE_R: RESISTOR, European symbol; SPICEMODEL: NONE; SPICEPREFIX: R
SENSOR2 = DeskAssistant v19 v1:ESP32_WROVER_BME680_BME680: Integrated Environmental Unit; AVAILABILITY: Unavailable; DESCRIPTION: Integrated Environmental Unit; MF: Bosch Sensortec; MP: BME680; PACKAGE: LGA-8 Bosch Tools; PRICE: None
SJ1 = DeskAssistant v19 v1:SJ: SMD solder JUMPER
TP1-TP17 = DeskAssistant v19 v1:TP: Test pad
U1 = DeskAssistant v19 v1:W25Q512JVEIQ: Check availability <https://pricing.snapeda.com/parts/W25Q512JVEIQ/Winbond%20Electronics/view-part?ref=eda>; AVAILABILITY: In Stock; CHECK_PRICES: https://www.snapeda.com/parts/W25Q512JVEIQ/Winbond+Electronics/view-part/?ref=eda; DESCRIPTION: FLASH - NOR Memory IC 512Mb (64M x 8) SPI - Quad I/O 133 MHz 8-WSON (8x6); MF: Winbond Electronics; MP: W25Q512JVEIQ; PACKAGE: Package; PRICE: None; SNAPEDA_LINK: https://www.snapeda.com/parts/W25Q512JVEIQ/Winbond+Electronics/view-part/?ref=snap
U2 = DeskAssistant v19 v1:ESP32-C6-WROOM-1-N8: Check availability <https://pricing.snapeda.com/parts/ESP32-C6-WROOM-1-N8/Espressif%20Systems/view-part?ref=eda>; AVAILABILITY: In Stock; CHECK_PRICES: https://www.snapeda.com/parts/ESP32-C6-WROOM-1-N8/Espressif+Systems/view-part/?ref=eda; DESCRIPTION: Multiprotocol Modules ESP32-C6 module, Wi-Fi 6 in 2.4 GHz band, Bluetooth 5, Zigbee 3.0 and Thread. ESP34-WROOM Compatible - ENGINEERING SAMPLE; MF: Espressif Systems; MP: ESP32-C6-WROOM-1-N8; PACKAGE: None; PRICE: None; SNAPEDA_LINK: https://www.snapeda.com/parts/ESP32-C6-WROOM-1-N8/Espressif+Systems/view-part/?ref=snap
U3 = DeskAssistant v19 v1:DS3231SN#: Real Time Clock Serial 16-Pin SOIC W T/R Check availability <https://pricing.snapeda.com/parts/DS3231SN%23/Analog%20Devices/view-part?ref=eda>; AVAILABILITY: In Stock; CHECK_PRICES: https://www.snapeda.com/parts/DS3231SN%23/Analog+Devices/view-part/?ref=eda; DESCRIPTION: Extremely Accurate I²C-Integrated RTC/TCXO/Crystal; MF: Analog Devices; MP: DS3231SN#; PACKAGE: SOIC-16 Maxim; PRICE: None; PURCHASE-URL: https://www.snapeda.com/api/url_track_click_mouser/?unipart_id=99048&manufacturer=Analog Devices&part_name=DS3231SN#&search_term=None; SNAPEDA_LINK: https://www.snapeda.com/parts/DS3231SN%23/Analog+Devices/view-part/?ref=snap
U4 = DeskAssistant v19 v1:MAX17048G+T10: Check availability <https://pricing.snapeda.com/parts/MAX17048G%2BT10/Analog%20Devices/view-part?ref=eda>; AVAILABILITY: In Stock; CHECK_PRICES: https://www.snapeda.com/parts/MAX17048G+T10/Analog+Devices/view-part/?ref=eda; DESCRIPTION: 3µA 1-Cell/2-Cell Fuel Gauge with ModelGauge; MF: Analog Devices; MP: MAX17048G+T10; PACKAGE: TDFN-8 Maxim; PRICE: None; PURCHASE-URL: https://www.snapeda.com/api/url_track_click_mouser/?unipart_id=329239&manufacturer=Analog Devices&part_name=MAX17048G+T10&search_term=None; SNAPEDA_LINK: https://www.snapeda.com/parts/MAX17048G+T10/Analog+Devices/view-part/?ref=snap